# Altium schematic sheet Top.SchDoc: XEM7360 Breakout Board - Top
size C; DrawnBy: Nick Kettman; Organization: Opal Kelly; Address1: 13500 SW 72nd Ave Ste 100; Address2: Portland, OR 97223; Address4: http://www.opalkelly.com/; DocumentNumber: xxx; Revision: A; SheetNumber: 1; SheetTotal: 3; ProjectName: BRK7360
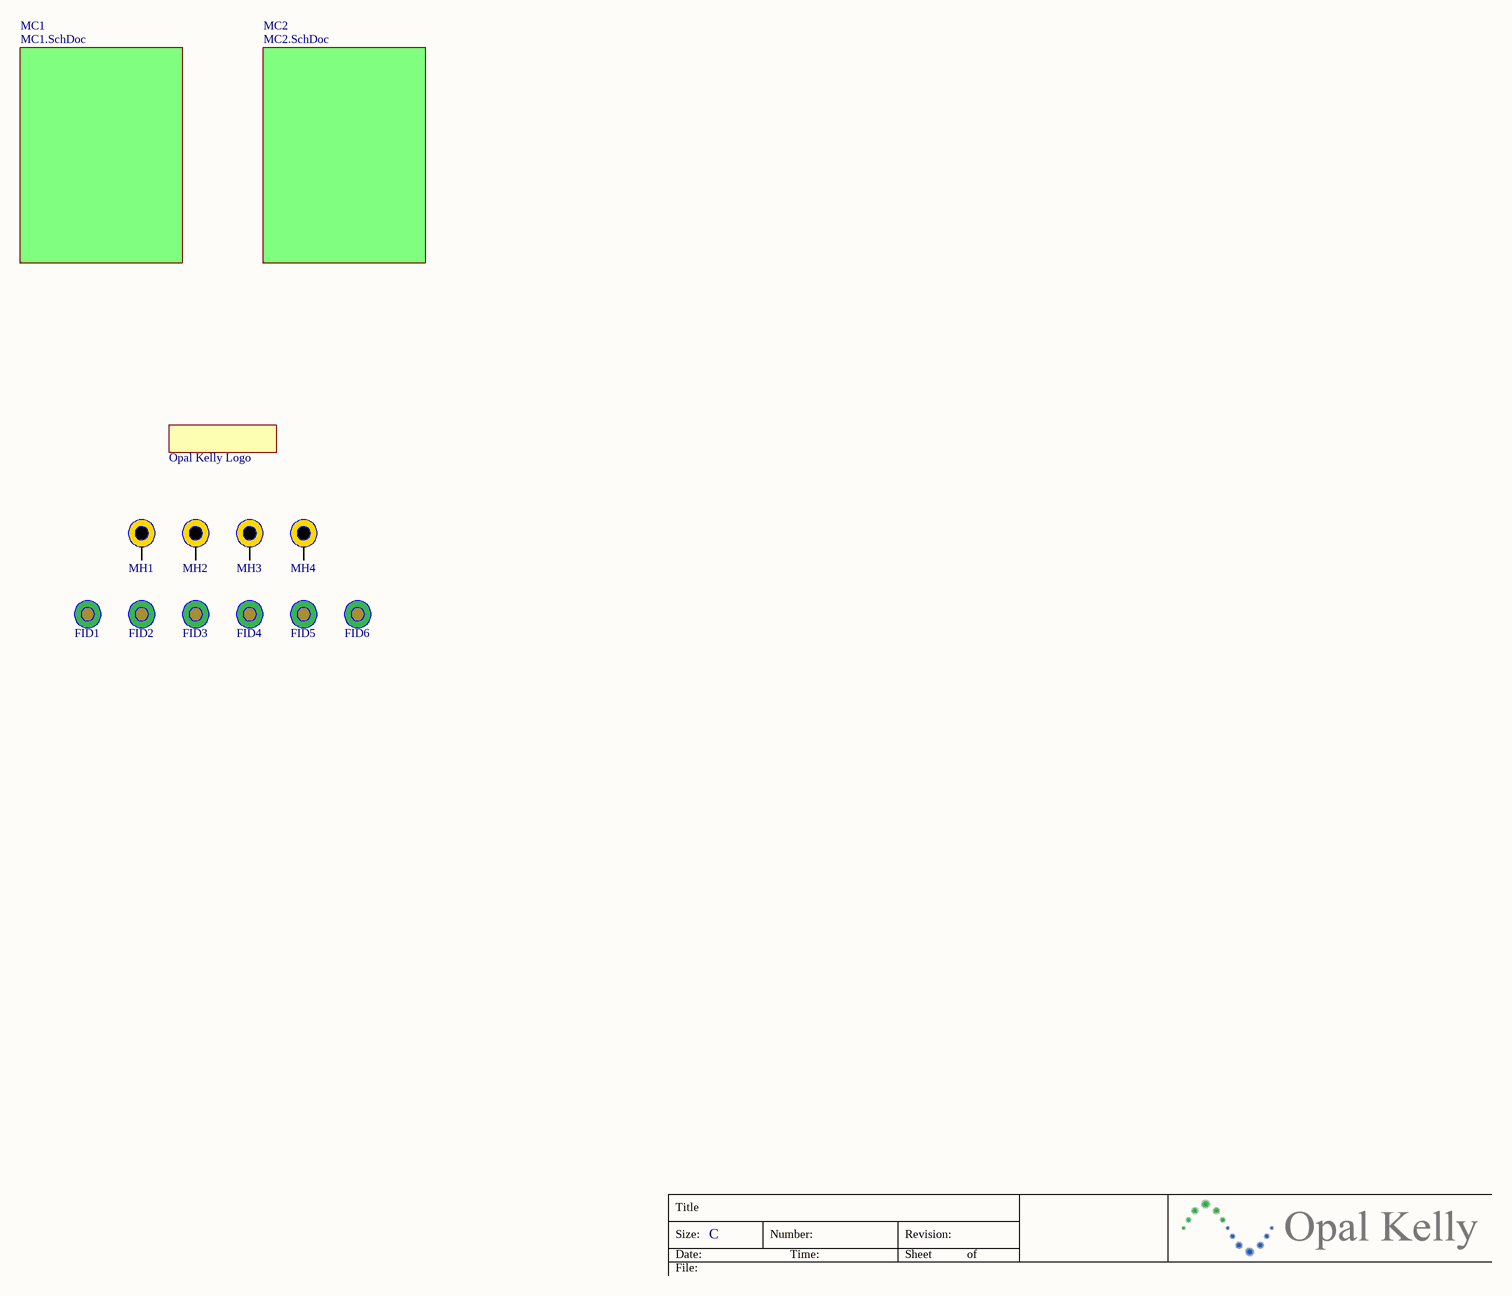
[diagram p0: Top.SchDoc]

## Parts
*1  Opal Kelly Logo  [okLogo-23x5]
FID1  FIDUCIAL  [FID1MM/2MM-SS]  (value not drawn)
FID2  FIDUCIAL  [FID1MM/2MM-SS]  (value not drawn)
FID3  FIDUCIAL  [FID1MM/2MM-SS]  (value not drawn)
FID4  FIDUCIAL  [FID1MM/2MM-SS]  (value not drawn)
FID5  FIDUCIAL  [FID1MM/2MM-SS]  (value not drawn)
FID6  FIDUCIAL  [FID1MM/2MM-SS]  (value not drawn)
MH1  MTG  [MTG-2.7/5.0-PTH]  (value not drawn)
MH2  MTG  [MTG-2.7/5.0-PTH]  (value not drawn)
MH3  MTG  [MTG-2.7/5.0-PTH]  (value not drawn)
MH4  MTG  [MTG-2.7/5.0-PTH]  (value not drawn)

## Sub-sheets
MC1 = MC1.SchDoc: no entries
MC2 = MC2.SchDoc: no entries

## Nets

Not connected (* = marked no-connect by the designer): MH1 1; MH2 1; MH3 1; MH4 1

## Notes on the sheet
- Title
- Size:
- Date:
- File:
- C
- Number:
- Time:
- Revision:
- Sheet
- of

## Library data of the parts
*1 = OKLOGO
FID1-FID6 = FIDUCIAL: PCB fiducial
MH1-MH4 = MTG: Mounting hole